# EAGLE design Seeeduino_co2 (EAGLE 9.5.1)
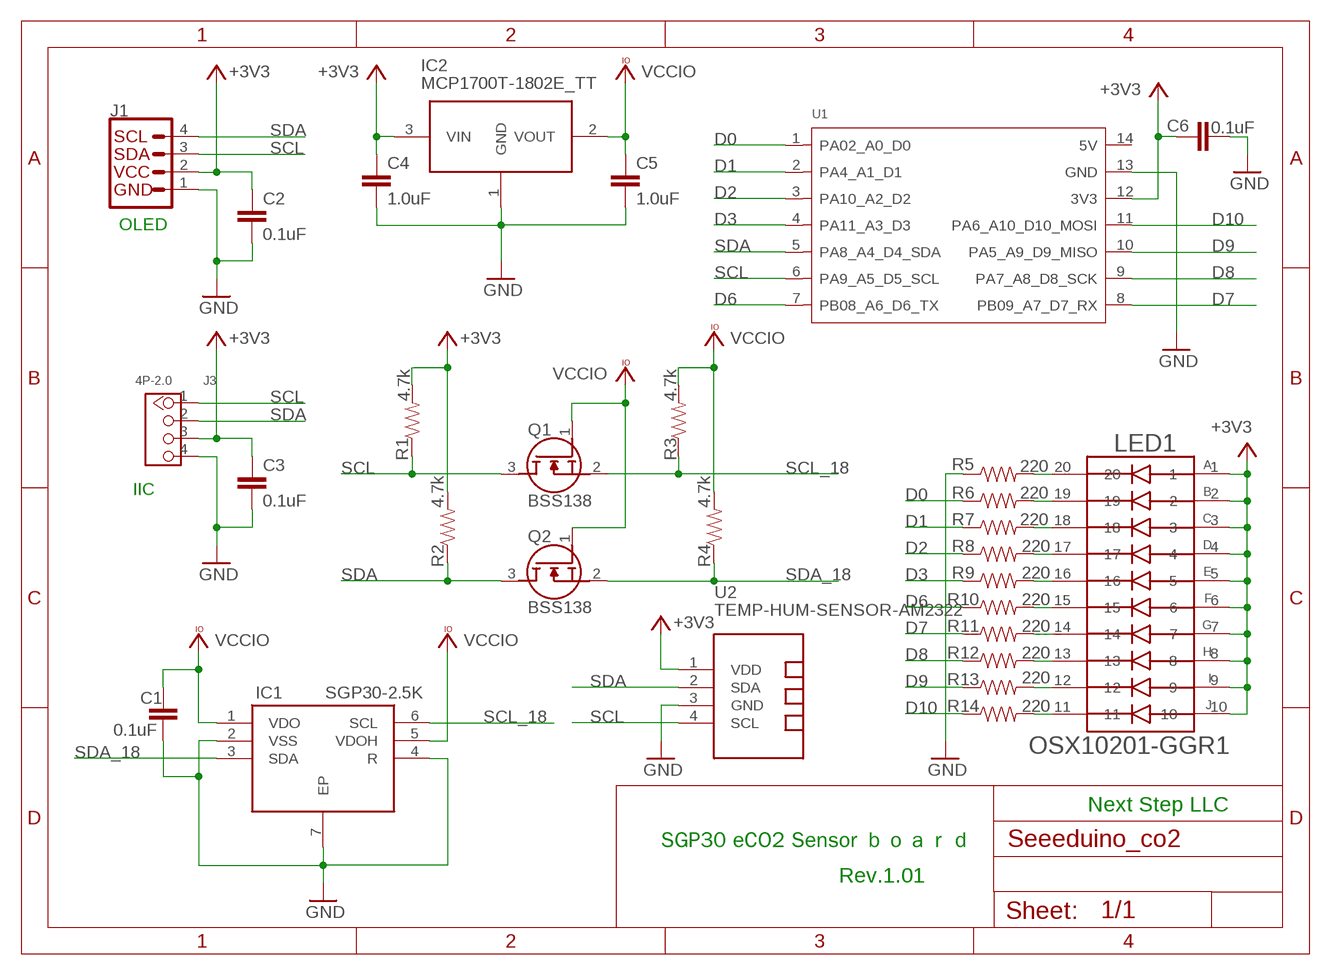
[diagram p0: schematic, sheet 1]

## Parts
C1  0.1uF  1.0UF-0402-16V-10%  [0402]
C2  0.1uF  1.0UF-0402-16V-10%  [0402]
C3  0.1uF  1.0UF-0402-16V-10%  [0402]
C4  1.0uF  1.0UF-0402-16V-10%  [0402]
C5  1.0uF  1.0UF-0402-16V-10%  [0402]
C6  0.1uF  1.0UF-0402-16V-10%  [0402]
IC1  SGP30-2.5K  [SON80P245X245X90-7N]
IC2  MCP1700T-1802E_TT  [SOT95P237X112-3N]
J1  I2C_STANDARD  [1X04]
J3  4P-2.0  GROVE-CONNECTOR-DIP(4P-2.0)  [HW4-2.0]
LED1  OSX10201-GGR1  [DIP760W45P254L2550H790Q20]
Q1  BSS138  [SOT95P240X120-3N]
Q2  BSS138  [SOT95P240X120-3N]
R1  4.7k  750OHM-0603-1/10W-1%  [0603]
R2  4.7k  750OHM-0603-1/10W-1%  [0603]
R3  4.7k  750OHM-0603-1/10W-1%  [0603]
R4  4.7k  750OHM-0603-1/10W-1%  [0603]
R5  220  750OHM-0603-1/10W-1%  [0603]
R6  220  750OHM-0603-1/10W-1%  [0603]
R7  220  750OHM-0603-1/10W-1%  [0603]
R8  220  750OHM-0603-1/10W-1%  [0603]
R9  220  750OHM-0603-1/10W-1%  [0603]
R10  220  750OHM-0603-1/10W-1%  [0603]
R11  220  750OHM-0603-1/10W-1%  [0603]
R12  220  750OHM-0603-1/10W-1%  [0603]
R13  220  750OHM-0603-1/10W-1%  [0603]
R14  220  750OHM-0603-1/10W-1%  [0603]
U1  MOUDLE-SEEEDUINO-XIAO  [MOUDLE14P-2.54-21X17.8MM]
U2  TEMP-HUM-SENSOR-AM2322  [TEMP-HUM-SENSOR-AM2322]

## Nets
+3V3: C2.1 C3.1 C4.1 C6.1 IC2.3(VIN) J1.2 J3.3 LED1.1 LED1.2 LED1.3 LED1.4 LED1.5 LED1.6 LED1.7 LED1.8 LED1.9 LED1.10 R1.2 R2.2 U1.12(3V3) U2.1(VDD)
D0: R6.1 U1.1(PA02_A0_D0)
D1: R7.1 U1.2(PA4_A1_D1)
D2: R8.1 U1.3(PA10_A2_D2)
D3: R9.1 U1.4(PA11_A3_D3)
D6: R10.1 U1.7(PB08_A6_D6_TX)
D7: R11.1 U1.8(PB09_A7_D7_RX)
D8: R12.1 U1.9(PA7_A8_D8_SCK)
D9: R13.1 U1.10(PA5_A9_D9_MISO)
D10: R14.1 U1.11(PA6_A10_D10_MOSI)
GND: C1.2 C2.2 C3.2 C4.2 C5.2 C6.2 IC1.2(VSS) IC1.4(R) IC1.7(EP) IC2.1(GND) J1.1 J3.4 R5.1 U1.13(GND) U2.3(GND)
N$1: LED1.11 R14.2
N$2: LED1.12 R13.2
N$3: LED1.13 R12.2
N$4: LED1.14 R11.2
N$5: LED1.15 R10.2
N$6: LED1.16 R9.2
N$7: LED1.17 R8.2
N$8: LED1.18 R7.2
N$9: LED1.19 R6.2
N$10: LED1.20 R5.2
SCL: J1.3 J3.1 Q1.3(D) R1.1 U1.6(PA9_A5_D5_SCL) U2.4(SCL)
SCL_18: IC1.6(SCL) Q1.2(S) R3.1
SDA: J1.4 J3.2 Q2.3(D) R2.1 U1.5(PA8_A4_D4_SDA) U2.2(SDA)
SDA_18: IC1.3(SDA) Q2.2(S) R4.1
VCCIO: C1.1 C5.1 IC1.1(VDO) IC1.5(VDOH) IC2.2(VOUT) Q1.1(G) Q2.1(G) R3.2 R4.2
Unconnected: U1.14(5V)

## Notes on the sheet
- OLED
- IIC
- Next Step LLC
- SGP30 eCO2 Sensor ｂｏａｒｄ
- Rev.1.01

## Library data of the parts
C1-C3 C6 = SparkFun-Capacitors:1.0UF: 1µF ceramic capacitors A capacitor is a passive two-terminal electrical component used to store electrical energy temporarily in an electric field.; PROD_ID: CAP-12417; VALUE: 1.0uF
C4 C5 = SparkFun-Capacitors:1.0UF: 1µF ceramic capacitors A capacitor is a passive two-terminal electrical component used to store electrical energy temporarily in an electric field.; PROD_ID: CAP-12417
IC1 = SamacSys_Parts:SGP30-2.5K: Air Quality Sensors Multi-Pixel SGP Gas Sensor Source: Datasheet; DESCRIPTION: Air Quality Sensors Multi-Pixel SGP Gas Sensor; HEIGHT: 0.9mm; MANUFACTURER_NAME: Sensirion; MANUFACTURER_PART_NUMBER: SGP30-2.5k; MOUSER_PART_NUMBER: 403-SGP30-2.5K; MOUSER_PRICE-STOCK: https://www.mouser.co.uk/ProductDetail/Sensirion/SGP30-25k?qs=HXFqYaX1Q2xVSiHQfO6Ujg%3D%3D
IC2 = SamacSys_Parts:MCP1700T-1802E_TT: Microchip MCP1700T-1802E/TT, LDO Voltage Regulator, 200mA, 1.8 V +/-2%, 2.3 6 Vin, 3-Pin SOT-23 Source: Datasheet; DESCRIPTION: Microchip MCP1700T-1802E/TT, LDO Voltage Regulator, 200mA, 1.8 V +/-2%, 2.3 6 Vin, 3-Pin SOT-23; HEIGHT: mm; MANUFACTURER_NAME: Microchip; MANUFACTURER_PART_NUMBER: MCP1700T-1802E/TT; MOUSER_PART_NUMBER: 579-MCP1700T1802E/TT; MOUSER_PRICE-STOCK: https://www.mouser.co.uk/ProductDetail/Microchip-Technology/MCP1700T-1802E-TT?qs=YUl711QUJY0TiDgzmNmFrg%3D%3D
J1 = SparkFun-Connectors:I2C_STANDARD: SparkFun I2C Standard Pinout Header SparkFun has standardized on a pinout for all I2C based sensor breakouts. This pinout allows I2C boards to be plugged directly into the headers on Arduino Uno compatible boards, and to be daisy chained easily. Example SparkFun Products: SparkFun Atmospheric Sensor Breakout - BME280 <https://www.sparkfun.com/products/13676> SparkFun Altitude/Pressure Sensor Breakout - MPL3115A2 <https://www.sparkfun.com/products/11084> SparkFun TOF Range Finder Sensor - VL6180 <https://www.sparkfun.com/products/12785>
J3 = OPL_Connector:GROVE-CONNECTOR-DIP(4P-2.0): 320110033
LED1 = OSX10201-GGR1:OSX10201-GGR1: Display: LED; bargraph; green (7x) / red (3x); 25.5x10.2x7.9mm; AVAILABILITY: Unavailable; DESCRIPTION: Display: LED; bargraph; green (7x) / red (3x); 25.5x10.2x7.9mm; MF: OptoSupply; MP: OSX10201-GGR1; PACKAGE: None; PRICE: None
Q1 Q2 = SamacSys_Parts:BSS138: N-channel MOSFET,BSS138 0.2A 50V Source: Datasheet <https://www.onsemi.com/pub/Collateral/BSS138-D.PDF>; DESCRIPTION: N-channel MOSFET,BSS138 0.2A 50V; HEIGHT: 1.2mm; MANUFACTURER_NAME: ON Semiconductor; MANUFACTURER_PART_NUMBER: BSS138; MOUSER_PART_NUMBER: 512-BSS138; MOUSER_PRICE-STOCK: https://www.mouser.co.uk/ProductDetail/ON-Semiconductor-Fairchild/BSS138?qs=HK%252BeIG1iaahCeqBvjB4arg%3D%3D
R1-R14 = SparkFun-Resistors:750OHM: 750Ω resistor A resistor is a passive two-terminal electrical component that implements electrical resistance as a circuit element. Resistors act to reduce current flow, and, at the same time, act to lower voltage levels within circuits. - Wikipedia; PROD_ID: RES-07824; VALUE: 750
U1 = Seeeduino XIAO:MOUDLE-SEEEDUINO-XIAO
U2 = diy-modules:TEMP-HUM-SENSOR-AM2322: AM2322 - digital humidity & temperature sensor More information about AM2322 is available here: http://www.electrodragon.com/w/AM2322 Click here to find device on ebay.com <http://www.ebay.com/sch/am2322+digital+sensor>

## Net classes
1 Power: width 0.559 mm, clearance 0.152 mm

## Board
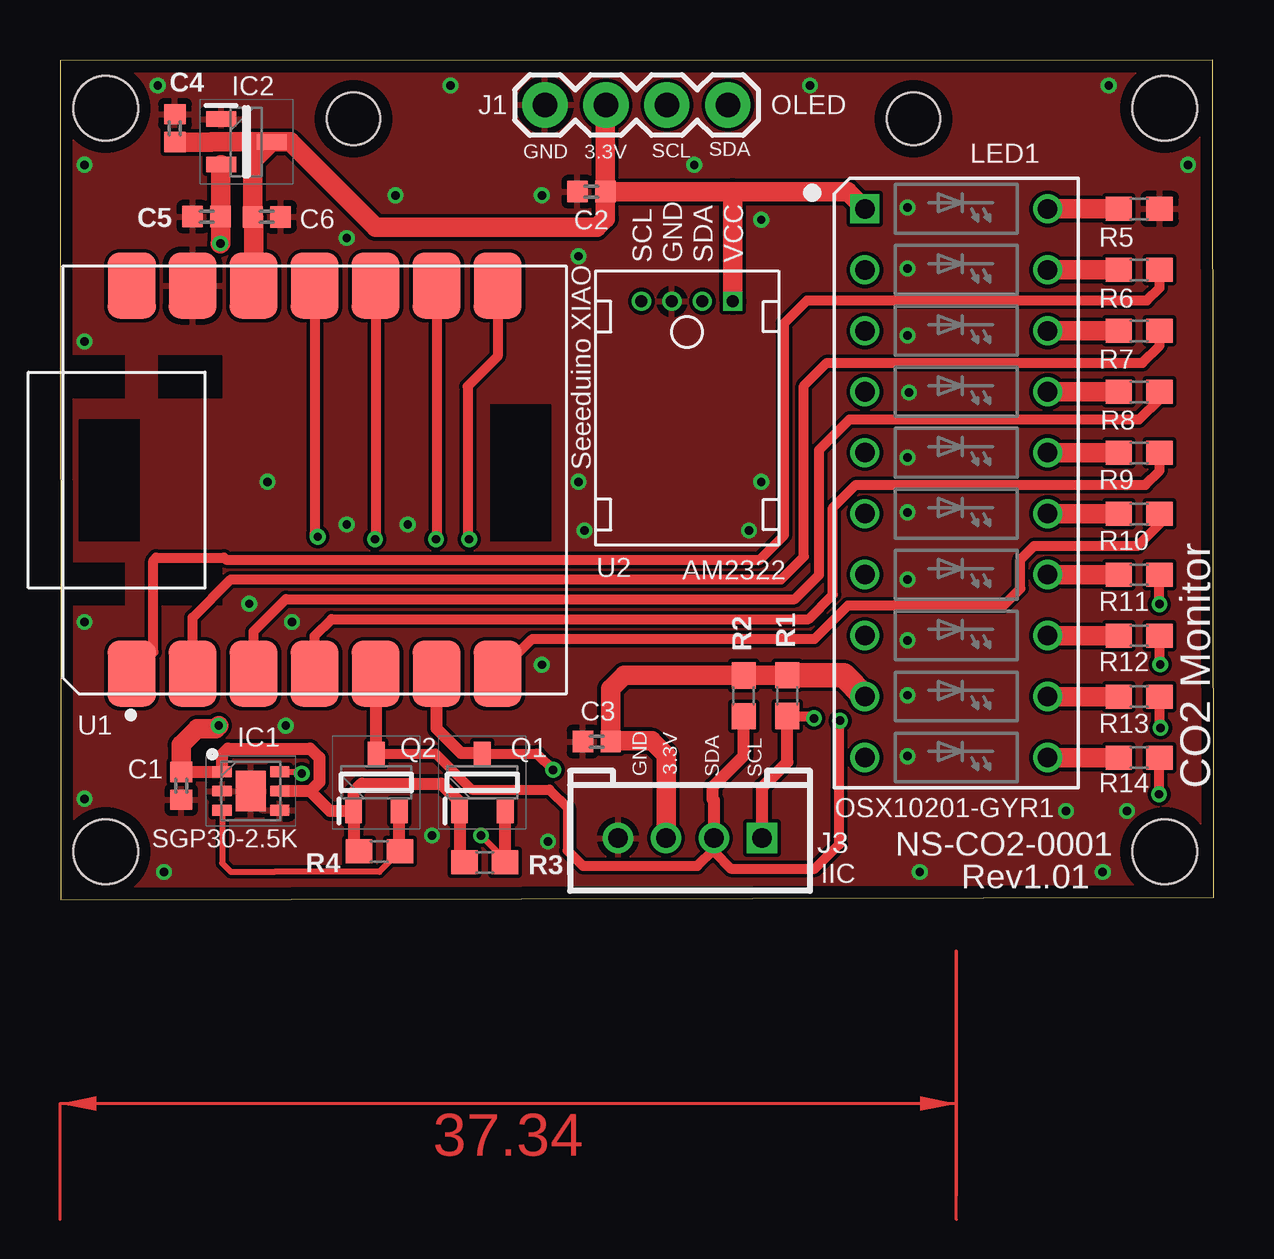
[diagram p1: board, top side]
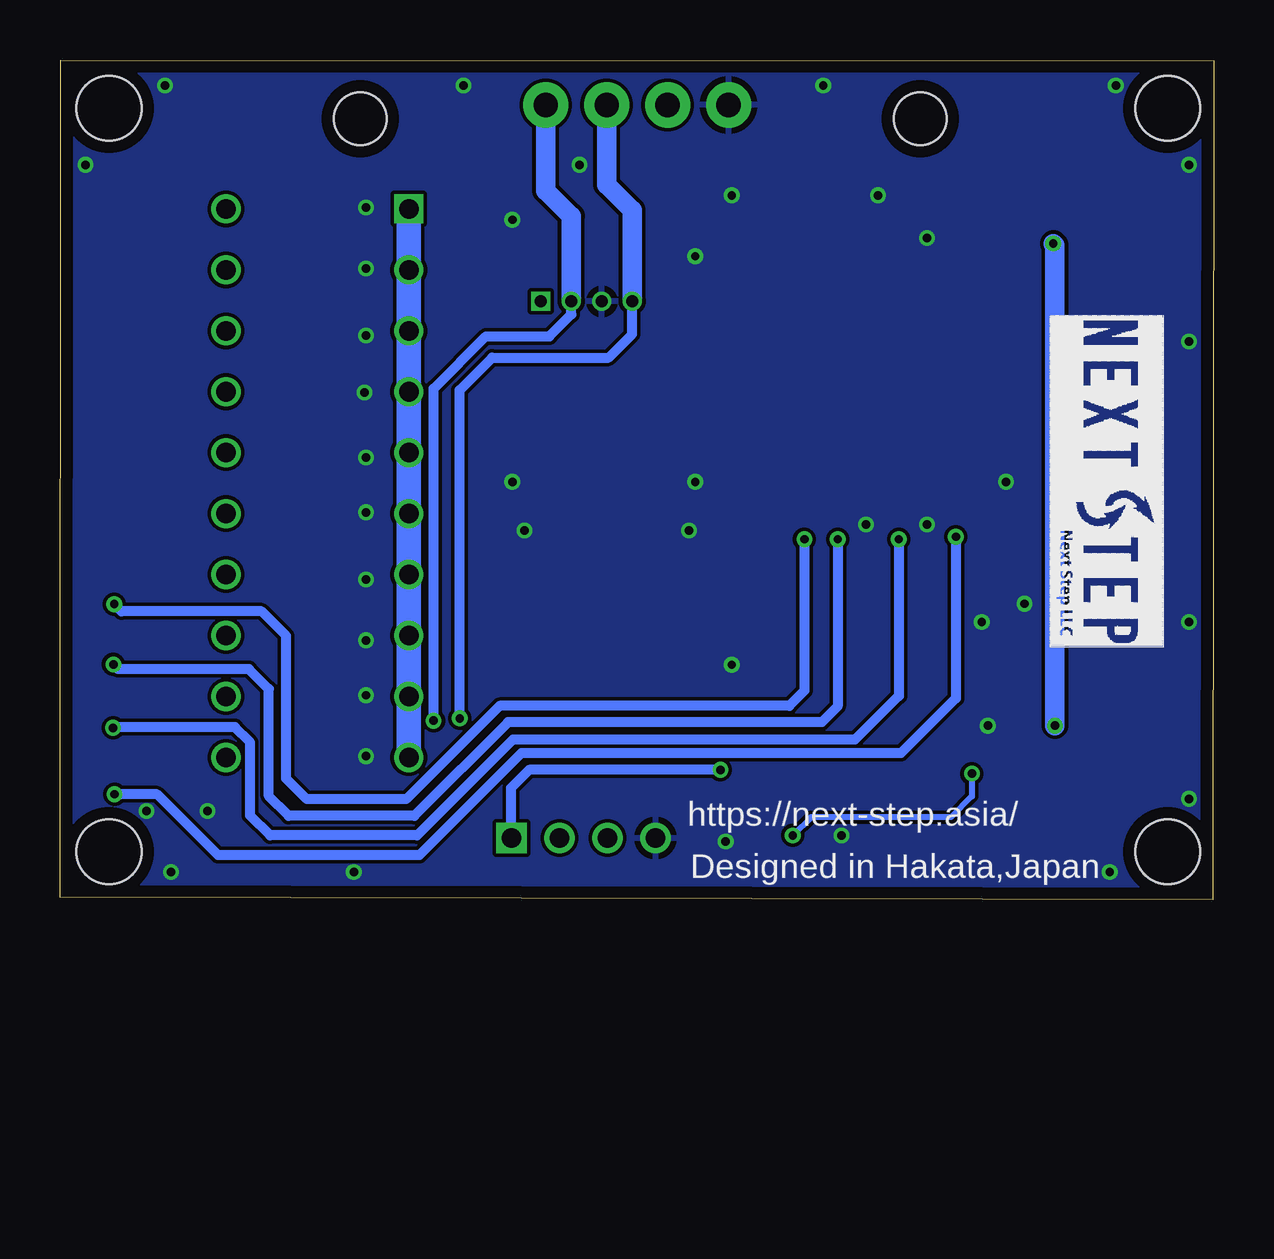
[diagram p2: board, bottom side, seen from below]

Size 48.07 x 34.99 mm. Coordinates in mm from the lower left corner, seen from the top.
Outline: 0.03,0 48.07,0.1 48.03,34.99 0,34.96 0.03,0
Copper layers (1*16): Top 0.035mm / dielectric 1.6mm / Bottom 0.035mm
Design rules "Elecrow_2-layer_PCB_eagle_rule": minimum track width 6mil, minimum drill 12mil, track to track 6mil, track to pad 6mil, pad to pad 6mil, via to via 8mil, smd to smd 0mil, copper to edge 20mil, drill to drill 10mil, minimum pad ring 6mil, minimum via ring 6mil, stop-mask expansion 0mil, vias tented up to drill 100mil, thermal gap 10mil
Holes 2.7 mm at 1.91,32.99 46.03,32.99 1.91,2 46.03,2
Holes 2.2 mm at 12.23,32.55 35.56,32.55

### Footprints (pad centres in the part's own frame; a part is rotated, then mirrored left to right if it is on the bottom)
0402 = smd 0.85 x 0.9: 1 -0.58,0; 2 0.58,0
SON80P245X245X90-7N = smd 0.8 x 0.45: 1 -1.2,0.8; 2 -1.2,0; 3 -1.2,-0.8; 4 1.2,-0.8; 5 1.2,0; 6 1.2,0.8 | smd 1.25 x 1.7: 7 0,0
SOT95P237X112-3N = smd 1.25 x 0.65: 1 -1.05,0.95; 2 -1.05,-0.95; 3 1.05,0
1X04 = drill 1.016 pad 1.88: 1 0,0; 2 2.54,0; 3 5.08,0; 4 7.62,0
HW4-2.0 = drill 0.8 pad 1.27 square: 1 -3,0 | drill 0.8 pad 1.27: 2 -1,0; 3 1,0; 4 3,0
DIP760W45P254L2550H790Q20 = drill 0.813 square: 1 -3.81,11.43 | drill 0.813: 2 -3.81,8.89; 3 -3.81,6.35; 4 -3.81,3.81; 5 -3.81,1.27; 6 -3.81,-1.27; 7 -3.81,-3.81; 8 -3.81,-6.35; 9 -3.81,-8.89; 10 -3.81,-11.43; 11 3.81,-11.43; 12 3.81,-8.89; 13 3.81,-6.35; 14 3.81,-3.81; 15 3.81,-1.27; 16 3.81,1.27; 17 3.81,3.81; 18 3.81,6.35; 19 3.81,8.89; 20 3.81,11.43
SOT95P240X120-3N = smd 1 x 0.7: 1 -1.2,0.95; 2 -1.2,-0.95; 3 1.2,0
0603 = smd 1.1 x 1: 1 -0.85,0; 2 0.85,0
MOUDLE14P-2.54-21X17.8MM = smd 2.75 x 2: 1 0.835,18.12; 2 0.835,15.58; 3 0.835,13.04; 4 0.835,10.5; 5 0.835,7.96; 6 0.835,5.42; 7 0.835,2.88; 8 17,2.88; 9 17,5.42; 10 17,7.96; 11 17,10.5; 12 17,13.04; 13 17,15.58; 14 17,18.12
TEMP-HUM-SENSOR-AM2322 = drill 0.5 square: 1 -1.905,-4.445 | drill 0.5: 2 -0.635,-4.445; 3 0.635,-4.445; 4 1.905,-4.445

### Placement (x,y rotation side)
C1  5.05,4.75 270 top
C2  22.14,29.51 180 top
C3  22.37,6.6 180 top
C4  4.79,32.15 90 top
C5  6.11,28.47 180 top
C6  8.61,28.46 0 top
IC1  7.95,4.53 0 top
IC2  7.76,31.58 0 top
J1  20.21,33.12 0 top
J3  26.25,2.58 180 top
LED1  37.35,17.36 0 top
Q1  17.6,4.89 90 top
Q2  13.18,4.89 90 top
R1  30.31,8.51 90 top
R2  28.48,8.5 90 top
R3  17.7,1.56 180 top
R4  13.31,2.02 180 top
R5  44.97,28.79 180 top
R6  44.97,26.25 180 top
R7  44.97,23.71 180 top
R8  44.97,21.17 180 top
R9  44.97,18.63 180 top
R10  44.97,16.09 180 top
R11  44.97,13.55 180 top
R12  44.97,11.01 180 top
R13  44.97,8.47 180 top
R14  44.97,5.93 180 top
U1  21.11,8.59 90 top
U2  26.13,20.5 180 top

### Tracks (layer width: path | path; a pad name or v marks a point on that pad's centre or on a via)
+3V3
  Top 0.813: U1.12 8.07,28.42 C6.1 8.03,30.8 IC2.3 | C4.1 6.29,31.57 6.32,31.6 7.11,31.6 7.13,31.58 IC2.3 | IC2.3 9.59,31.58 13.16,28.02 22.36,28.02 22.72,28.38 C2.1 | C2.1 22.72,33.09 J1.2 | C2.1 28.01,29.51 | 28.01,29.51 32.81,29.51 LED1.1 | J3.3 25.25,6.02 24.65,6.62 22.97,6.62 C3.1 22.95,8.79 23.51,9.35 R2.2 28.49,9.36 R1.2 | U2.1 28.03,29.49 28.01,29.51
  Top 1.016: LED1.9 32.65,9.36 R1.2
  Bottom 1.016: LED1.1 LED1.2 LED1.3 LED1.4 LED1.5 LED1.6 LED1.7 LED1.8 LED1.9 LED1.10
D0
  Top 0.406: U1.1 3.89,10.32 3.89,14.14 4.01,14.25 6.84,14.25 6.92,14.18 29.16,14.18 30.17,15.19 30.17,24.02 31.13,24.97 45.29,24.97 45.82,25.5 R6.1
D1
  Top 0.406: U1.2 5.53,11.76 7.12,13.35 30.05,13.35 31,14.3 31,21.42 31.95,22.37 45.1,22.37 45.82,23.09 R7.1
D2
  Top 0.406: U1.3 8.07,11.19 9.41,12.53 30.62,12.53 31.63,13.54 31.63,18.75 32.9,20.02 44.97,20.02 45.82,20.87 R8.1
D3
  Top 0.406: U1.4 10.61,11 11.31,11.7 31.19,11.7 32.2,12.72 32.2,16.34 33.16,17.29 45.22,17.29 45.82,17.88 R9.1
D6
  Top 0.406: U1.7 19.68,10.88 31.44,10.88 32.84,12.27 39.32,12.27 40.02,12.97 40.02,14.18 40.59,14.75 44.91,14.75 45.82,15.66 R10.1
D7  (via drill 0.35)
  Top 0.406: U1.8 18.23,22.65 16.98,21.4 16.98,15.09 v17.05,15.03 | v45.81,12.32 45.81,13.54 R11.1
  Bottom 0.406: v17.05,15.03 17.05,8.72 17.68,8.09 29.75,8.09 33.64,4.2 37.79,4.2 38.64,5.05 38.64,11 39.67,12.02 45.51,12.02 v45.81,12.32
D8  (via drill 0.35)
  Top 0.406: U1.9 15.69,15.05 v15.66,15.03 | v45.84,9.81 45.82,9.84 R12.1
  Bottom 0.406: v15.66,15.03 15.66,8.06 16.32,7.4 29.4,7.4 33.3,3.5 38.54,3.5 39.37,4.32 39.37,8.78 40.2,9.61 45.64,9.61 v45.84,9.81
D9  (via drill 0.35)
  Top 0.406: U1.10 13.15,15.06 v13.12,15.03 | v45.86,7.17 45.82,7.21 R13.1
  Bottom 0.406: v13.12,15.03 13.12,8.5 14.95,6.67 29.2,6.67 33.19,2.68 39.32,2.68 40.14,3.51 40.14,6.56 40.78,7.19 45.86,7.19 v45.86,7.17
D10  (via drill 0.35)
  Top 0.406: U1.11 10.61,15.26 v10.74,15.13 | v45.79,4.4 45.79,5.91 R14.1
  Bottom 0.406: v10.74,15.13 10.74,8.4 13.03,6.11 28.84,6.11 33.09,1.86 41.48,1.86 44.02,4.4 v45.79,4.4
GND  (via drill 0.35)
  other vias: 35.37,21.14 1.03,4.21 4.33,1.16 15.5,2.68 20.33,2.43 35.82,1.16 43.44,1.16 44.46,3.7 47,30.62 43.7,33.93 31.25,33.93 16.27,33.93 4.07,33.93 1.03,30.62 29.22,17.42 21.6,17.42 8.65,17.42 1.03,11.57 1.03,23.26 11.95,27.58 13.98,29.35 20.08,29.35 21.6,26.81 26.43,30.62 29.22,28.34 28.71,15.38 21.85,15.38 14.49,15.64 11.95,15.64 20.08,9.8 9.66,11.57 7.88,12.34 9.41,7.26 41.92,3.7 35.32,5.99 35.32,8.53 35.32,10.81 35.32,13.35 35.32,16.15 35.32,18.43 35.32,23.51 35.32,26.31 35.32,28.85
  pour Top: 0,35.35 48.16,35.35 48.16,0 0,0
  pour Bottom: 0,35.35 48.06,35.35 48.06,0 0,0
N$1
  Top 0.813: LED1.11 R14.2
N$2
  Top 0.813: LED1.12 R13.2
N$3
  Top 0.813: LED1.13 R12.2
N$4
  Top 0.813: LED1.14 R11.2
N$5
  Top 0.813: LED1.15 R10.2
N$6
  Top 0.813: LED1.16 R9.2
N$7
  Top 0.813: LED1.17 R8.2
N$8
  Top 0.813: LED1.18 R7.2
N$9
  Top 0.813: LED1.19 R6.2
N$10
  Top 0.813: LED1.20 R5.2
N$11
  Top 0.152: 37.35,-12.3 37.35,-2.14
SCL  (via drill 0.35)
  Top 0.406: Q1.3 19.87,6.09 v20.55,5.42 | R1.1 31.32,7.66 v31.41,7.56
  Top 0.508: Q1.3 17.58,6.11 16.71,6.11 15.69,7.13 U1.6 | J3.1 29.25,4.68 30.31,5.74 R1.1
  Bottom 0.406: v20.55,5.42 28.52,5.42 29.28,4.65 29.28,2.61 J3.1 | v31.41,7.56 31.41,21.23 30.06,22.59 25.2,22.59 24.22,23.57 U2.4
  Bottom 0.813: U2.4 24.22,28.74 25.29,29.8 J1.3
SCL_18  (via drill 0.35)
  Top 0.254: IC1.6 10,5.33 v10.07,5.26 | v17.54,2.68 18.55,1.67 R3.1
  Top 0.508: R3.1 Q1.2
  Bottom 0.254: v10.07,5.26 10.07,4.31 10.93,3.45 16.77,3.45 v17.54,2.68
SDA  (via drill 0.35)
  Top 0.406: Q2.3 15.65,6.09 17.16,4.59 20.39,4.59 21.16,3.83 21.16,2.05 21.79,1.41 26.55,1.41 27.25,2.11 J3.2 27.25,2 27.95,1.3 31.46,1.3 32.47,2.31 32.47,7.43 v32.5,7.46
  Top 0.508: Q2.3 13.18,9.39 U1.5 | J3.2 27.25,4.15 27.19,4.21 27.19,4.72 28.48,6.01 R2.1
  Bottom 0.406: v32.5,7.46 32.5,21.3 30.32,23.48 27.68,23.48 26.76,24.4 U2.2
  Bottom 0.813: U2.2 26.76,28.49 27.83,29.55 J1.4
SDA_18
  Top 0.254: IC1.3 6.75,1.53 7.12,1.16 8.95,1.16 13.31,1.17 R4.1
  Top 0.508: R4.1 14.13,2.05 Q2.2
VCCIO  (via drill 0.35)
  Top 0.508: C1.1 IC1.1 6.75,6.06 7,6.3 10.42,6.3 10.81,5.92 10.81,4.91 10.42,4.53 | 10.42,4.53 9.16,4.53 IC1.5 | Q2.1 11.26,3.69 10.42,4.53 | R3.2 16.65,1.75 Q1.1 16.65,4.08 15.89,4.84 12.58,4.84 12.23,4.49 Q2.1 | Q2.1 12.23,2.25 R4.2
  Top 0.813: IC2.2 6.69,30.61 C5.1 6.69,27.35 v6.68,27.34 | v6.61,7.26 6.49,7.13 5.73,7.13 5.05,6.46 C1.1
  Bottom 0.813: v6.68,27.34 6.62,27.28 v6.62,7.26 v6.61,7.26
(copper drawn outside any net)
  shapes: Top area x1

### Text on the board
tPlace: OLED | SCL | SDA | GND | 3.3V | SCL | GND | SDA | VCC | Seeeduino XIAO | AM2322 | GND | 3.3V | SDA | SCL | CO2 Monitor | OSX10201-GYR1 | SGP30-2.5K | NS-CO2-0001 | IIC | Rev1.01
bPlace: https://next-step.asia/ | Designed in Hakata,Japan